# Altium project STLinkUART.PrjPcb
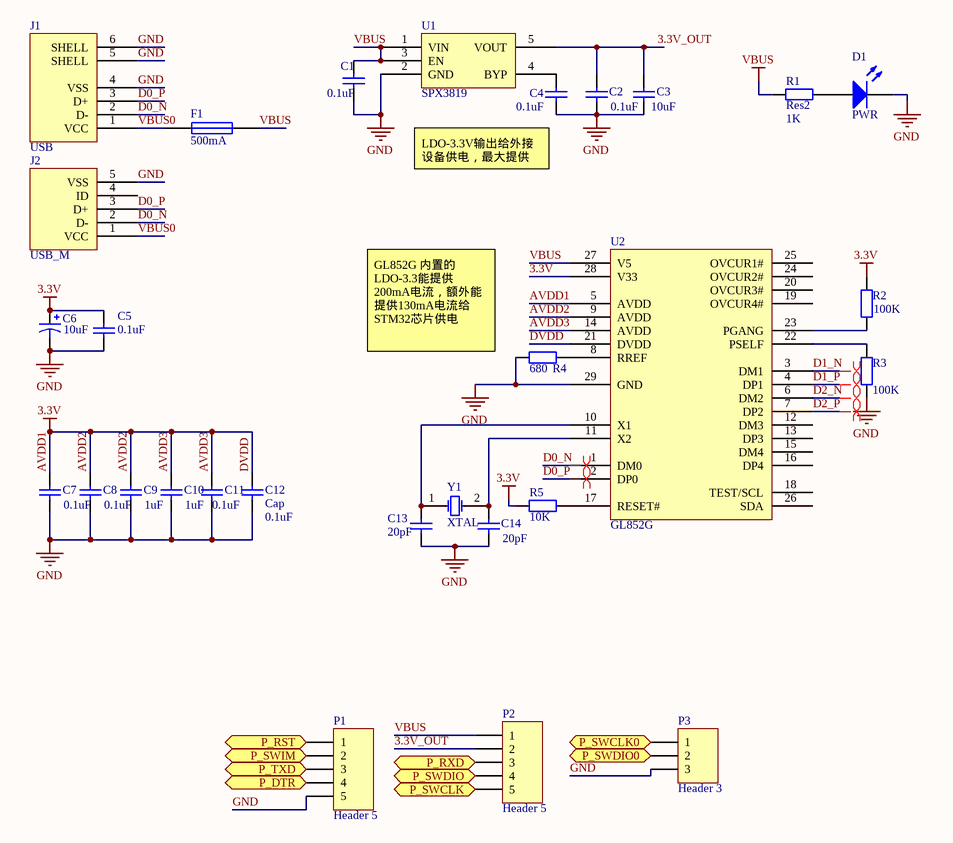
[diagram p0: USBHost.SchDoc]
3 sheets, 66 parts. Net scope: global (net labels, ports and power ports of the same name join across sheets).
Board file: STLinkUART.PcbDoc
Sheets:
  USBHost.SchDoc
  UART.SchDoc
  STLink.SchDoc

## Sheet USBHost.SchDoc
size A; PageSetup: Record=PageOptions|CenterHorizontal=True|CenterVertical=True|PrintScale=1.07|XCorrection=1.00|YCorrection=1.00|PrintKind=1|BorderSize=5000000|LeftOffset=0|BottomOffset=0|Orientation=2|PaperLength=1000|PaperWidth=1000|Scale=100|PaperSource=257|PrintQuality=600|MediaType=1|DitherType=10|PrintScaleMode=1|PaperKind=Letter|PaperIndex=1

### Parts
C1  value 0.1uF  [C-0603]  (hidden comment: Cap)
C2  value 0.1uF  [C-0603]  (hidden comment: Cap)
C3  value 10uF  [C-0603]  (hidden comment: Cap)
C4  value 0.1uF  [C-0603]  (hidden comment: Cap)
C5  value 0.1uF  [C-0603]  (hidden comment: Cap)
C6  value 10uF  [C-0603]  (hidden comment: Cap Pol1)
C7  value 0.1uF  [C-0603]  (hidden comment: Cap)
C8  value 0.1uF  [C-0603]  (hidden comment: Cap)
C9  value 1uF  [C-0603]  (hidden comment: Cap)
C10  value 1uF  [C-0603]  (hidden comment: Cap)
C11  value 0.1uF  [C-0603]  (hidden comment: Cap)
C12  Cap  value 0.1uF  [C-0603]
C13  value 20pF  [C-0603]  (hidden comment: Cap)
C14  value 20pF  [C-0603]  (hidden comment: Cap)
D1  PWR  [SMT_LED_0603]
F1  value 500mA  [0805-1]  (hidden comment: Fuse1)
J1  USB  [USB-B]
J2  USB_M  [USB_MICRO_5S_B]
P1  Header 5  [HEADER 5]
P2  Header 5  [HEADER 5]
P3  Header 3  [SIP3-1.27]
R1  Res2  value 1K  [0603-1]
R2  value 100K  [0603-1]  (hidden comment: Res2)
R3  value 100K  [0603-1]  (hidden comment: Res2)
R4  value 680  [0603-1]  (hidden comment: Res1)
R5  value 10K  [0603-1]  (hidden comment: Res2)
U1  SPX3819  [SOT23-5]
U2  GL852G  [QFN28-L]
Y1  XTAL  [XAL5032 2-Leads]

### Ports
P_DTR, P_RST, P_RXD, P_SWCLK, P_SWCLK0, P_SWDIO, P_SWDIO0, P_SWIM, P_TXD

### Nets
3.3V: C5.1 C6.1 C7.2 C8.2 C9.2 C10.2 C11.2 C12.2 R2.2 R5.2 U2.5(AVDD) U2.9(AVDD) U2.14(AVDD) U2.21(DVDD) U2.28(V33)  [also labelled AVDD1, AVDD2, AVDD3, DVDD]
GND: C1.1 C2.1 C3.1 C4.1 C5.2 C6.2 C7.1 C8.1 C9.1 C10.1 C11.1 C12.1 C13.1 C14.1 D1.2(K) J1.4(VSS) J1.5(SHELL) J1.6(SHELL) J2.5(VSS) P1.5 P3.3 R3.1 R4.1 U1.2(GND) U2.29(GND)
VBUS: C1.2 F1.1 P2.1 R1.1 U1.1(VIN) U1.3(EN) U2.27(V5)
3.3V_OUT: C2.2 C3.2 P2.2 U1.5(VOUT)
D0_N: J1.2(D-) J2.2(D-) U2.1(DM0)
D0_P: J1.3(D+) J2.3(D+) U2.2(DP0)
D1_N: U2.3(DM1)
D1_P: U2.4(DP1)
D2_N: U2.6(DM2)
D2_P: U2.7(DP2)
DTR: P1.4 ; port P_DTR
P_RST: P1.1 ; port P_RST
P_SWCLK: P2.5 ; port P_SWCLK
P_SWDIO: P2.4 ; port P_SWDIO
P_SWIM: P1.2 ; port P_SWIM
RXD: P2.3 ; port P_RXD
SWCLK0: P3.1 ; port P_SWCLK0
SWDIO0: P3.2 ; port P_SWDIO0
TXD: P1.3 ; port P_TXD
VBUS0: F1.2 J1.1(VCC) J2.1(VCC)
NetC4_2: C4.2 U1.4(BYP)
NetC13_2: C13.2 U2.10(X1) Y1.1(OSC1)
NetC14_2: C14.2 U2.11(X2) Y1.2(OSC2)
NetD1_1: D1.1(A) R1.2
NetR2_1: R2.1 U2.23(PGANG)
NetR3_2: R3.2 U2.22(PSELF)
NetR4_2: R4.2 U2.8(RREF)
NetR5_1: R5.1 U2.17(RESET#)

Not connected (* = marked no-connect by the designer): J2 4(ID); U2 12(DM3) 13(DP3) 15(DM4) 16(DP4) 18(TEST/SCL) 19(OVCUR4#) 20(OVCUR3#) 24(OVCUR2#) 25(OVCUR1#) 26(SDA)

### Layout directives
differential pair: D0_N, D0_P, D1_N, D1_P, D2_N, D2_P

### Notes on the sheet
- (near C4) LDO-3.3V输出给外接设备供电，最大提供500mA电流
- (near R4) GL852G 内置的LDO-3.3能提供200mA电流，额外能提供130mA电流给STM32芯片供电

### Library data of the parts
C1-C5 C7-C14 = Cap: Capacitor; Published: 8-Jun-2000; LatestRevisionDate: 17-Jul-2002; LatestRevisionNote: Re-released for DXP Platform.; PackageReference: RAD-0.3; Publisher: Altium Limited; PackageDescription: Radial Cap, Thru-Hole; 2 Leads; 0.3 in Pin Spacing
C6 = Cap Pol1: Polarized Capacitor (Radial); Published: 8-Jun-2000; LatestRevisionDate: 17-Jul-2002; LatestRevisionNote: Re-released for DXP Platform.; PackageReference: RB7.6-15; Publisher: Altium Limited; PackageDescription: Polarized Capacitor (Radial); 2 Leads
D1 = LED2: Typical RED, GREEN, YELLOW, AMBER GaAs LED; Published: 8-Jun-2000; LatestRevisionDate: 17-Jul-2002; LatestRevisionNote: Re-released for DXP Platform.; PackageVersion: Feb-2002; PackageReference: 3.2X1.6X1.1; Publisher: Altium Limited; PackageDescription: SM LED; 2 Flat Leads
F1 = Fuse1: 保险丝
J1 = USB: USB接口
J2 = USB_M: Micro/Mini USB
P1 P2 = Header 5: Header, 5-Pin; LatestRevisionDate: 17-Jul-2002; LatestRevisionNote: Re-released for DXP Platform.; Publisher: Altium Limited
P3 = Header 3: Header, 3-Pin; LatestRevisionDate: 17-Jul-2002; LatestRevisionNote: Re-released for DXP Platform.; Publisher: Altium Limited
R1-R3 R5 = Res2: Resistor; Published: 8-Jun-2000; LatestRevisionDate: 17-Jul-2002; LatestRevisionNote: Re-released for DXP Platform.; PackageReference: AXIAL-0.4; Publisher: Altium Limited; PackageDescription: Axial Device, Thru-Hole; 2 Leads; 0.4 in Pin Spacing
R4 = Res1: 贴片电阻; Published: 8-Jun-2000; LatestRevisionDate: 17-Jul-2002; LatestRevisionNote: Re-released for DXP Platform.; PackageReference: AXIAL-0.4; Publisher: Altium Limited
Y1 = XTAL: Crystal Oscillator; Published: 8-Jun-2000; LatestRevisionDate: 17-Jul-2002; LatestRevisionNote: Re-released for DXP Platform.; PackageReference: R38; Publisher: Altium Limited; PackageDescription: Crystal, Thru-Hole; 2 Leads; Body 3.1 x 8.2 mm (Dia.xH)

## Sheet UART.SchDoc
size A; PageSetup: Record=PageOptions|CenterHorizontal=True|CenterVertical=True|PrintScale=1.07|XCorrection=1.00|YCorrection=1.00|PrintKind=1|BorderSize=5000000|LeftOffset=0|BottomOffset=0|Orientation=2|PaperLength=1000|PaperWidth=1000|Scale=100|PaperSource=257|PrintQuality=600|MediaType=1|DitherType=10|PrintScaleMode=1|PaperKind=Letter|PaperIndex=1
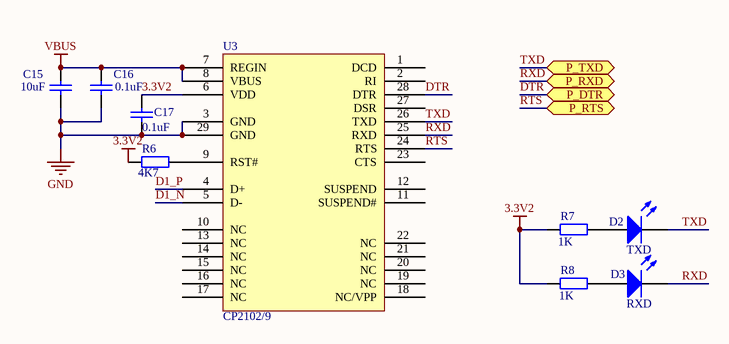
[diagram p1: UART.SchDoc]

### Parts
C15  value 10uF  [C-0603]  (hidden comment: Cap)
C16  value 0.1uF  [C-0603]  (hidden comment: Cap)
C17  value 0.1uF  [C-0603]  (hidden comment: Cap)
D2  TXD  [SMT_LED_0603]
D3  RXD  [SMT_LED_0603]
R6  value 4K7  [0603-1]  (hidden comment: Res2)
R7  value 1K  [0603-1]  (hidden comment: Res2)
R8  value 1K  [0603-1]  (hidden comment: Res2)
U3  CP2102/9  [QFN28-L]

### Ports
P_DTR, P_RTS, P_RXD, P_TXD

### Nets
3.3V2: C17.2 R6.1 R7.1 R8.1 U3.6(VDD)
GND: C15.1 C16.1 C17.1 U3.3(GND) U3.29(GND)
VBUS: C15.2 C16.2 U3.7(REGIN) U3.8(VBUS)
D1_N: U3.5(D-)
D1_P: U3.4(D+)
DTR: U3.28(DTR) ; port P_DTR
RTS: U3.24(RTS) ; port P_RTS
RXD: D3.2(K) U3.25(RXD) ; port P_RXD
TXD: D2.2(K) U3.26(TXD) ; port P_TXD
NetD2_1: D2.1(A) R7.2
NetD3_1: D3.1(A) R8.2
NetR6_2: R6.2 U3.9(RST#)

Not connected (* = marked no-connect by the designer): U3 1(DCD) 2(RI) 10(NC) 11(SUSPEND#) 12(SUSPEND) 13(NC) 14(NC) 15(NC) 16(NC) 17(NC) 18(NC/VPP) 19(NC) 20(NC) 21(NC) 22(NC) 23(CTS) 27(DSR)

### Library data of the parts
C15-C17 = Cap: Capacitor; Published: 8-Jun-2000; LatestRevisionDate: 17-Jul-2002; LatestRevisionNote: Re-released for DXP Platform.; PackageReference: RAD-0.3; Publisher: Altium Limited; PackageDescription: Radial Cap, Thru-Hole; 2 Leads; 0.3 in Pin Spacing
D2 D3 = LED2: as D1 on sheet USBHost; Published: 8-Jun-2000; LatestRevisionDate: 17-Jul-2002; LatestRevisionNote: Re-released for DXP Platform.; PackageVersion: Feb-2002; PackageReference: 3.2X1.6X1.1; Publisher: Altium Limited; PackageDescription: SM LED; 2 Flat Leads
R6-R8 = Res2: Resistor; Published: 8-Jun-2000; LatestRevisionDate: 17-Jul-2002; LatestRevisionNote: Re-released for DXP Platform.; PackageReference: AXIAL-0.4; Publisher: Altium Limited; PackageDescription: Axial Device, Thru-Hole; 2 Leads; 0.4 in Pin Spacing

## Sheet STLink.SchDoc
size A; PageSetup: Record=PageOptions|CenterHorizontal=True|CenterVertical=True|PrintScale=1.07|XCorrection=1.00|YCorrection=1.00|PrintKind=1|BorderSize=5000000|LeftOffset=0|BottomOffset=0|Orientation=2|PaperLength=1000|PaperWidth=1000|Scale=100|PaperSource=257|PrintQuality=600|MediaType=1|DitherType=10|PrintScaleMode=1|PaperKind=Letter|PaperIndex=1
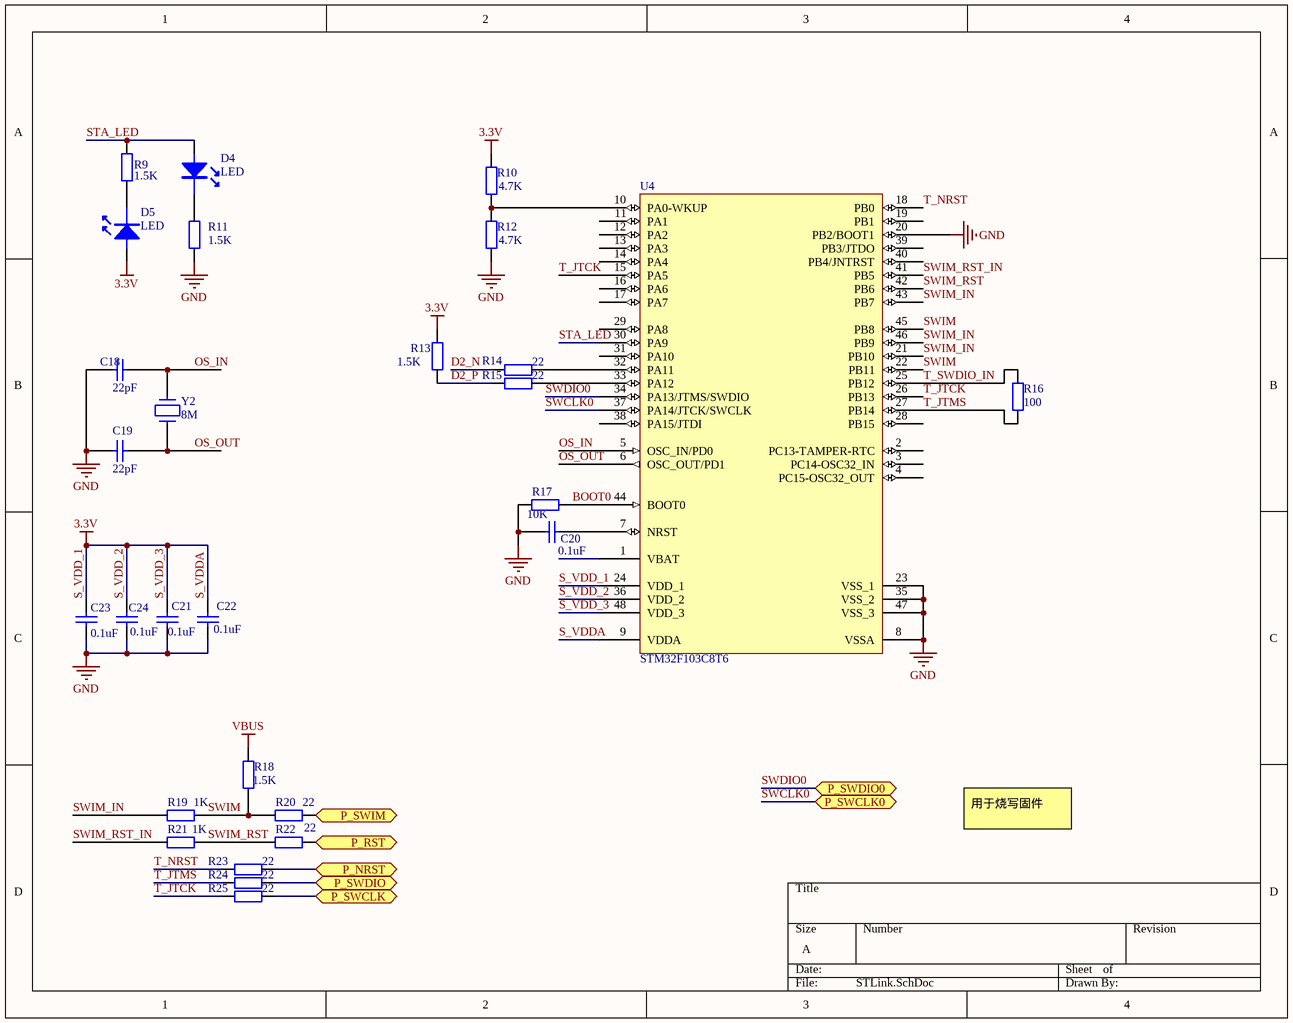
[diagram p2: STLink.SchDoc]

### Parts
C18  value 22pF  [C-0603]  (hidden comment: Cap)
C19  value 22pF  [C-0603]  (hidden comment: Cap)
C20  value 0.1uF  [C-0603]  (hidden comment: Cap)
C21  value 0.1uF  [C-0603]  (hidden comment: Cap)
C22  value 0.1uF  [C-0603]  (hidden comment: Cap)
C23  value 0.1uF  [C-0603]  (hidden comment: Cap)
C24  value 0.1uF  [C-0603]  (hidden comment: Cap)
D4  LED  [SMT_LED_0603]
D5  LED  [SMT_LED_0603]
R9  value 1.5K  [0603-1]  (hidden comment: Res2)
R10  value 4.7K  [0603-1]  (hidden comment: Res2)
R11  value 1.5K  [0603-1]  (hidden comment: Res2)
R12  value 4.7K  [0603-1]  (hidden comment: Res2)
R13  value 1.5K  [0603-1]  (hidden comment: Res2)
R14  value 22  [0603-1]  (hidden comment: Res2)
R15  value 22  [0603-1]  (hidden comment: Res2)
R16  value 100  [0603-1]  (hidden comment: Res2)
R17  value 10K  [0603-1]  (hidden comment: Res2)
R18  value 1.5K  [0603-1]  (hidden comment: Res2)
R19  value 1K  [0603-1]  (hidden comment: Res2)
R20  value 22  [0603-1]  (hidden comment: Res2)
R21  value 1K  [0603-1]  (hidden comment: Res2)
R22  value 22  [0603-1]  (hidden comment: Res2)
R23  value 22  [0603-1]  (hidden comment: Res2)
R24  value 22  [0603-1]  (hidden comment: Res2)
R25  value 22  [0603-1]  (hidden comment: Res2)
U4  STM32F103C8T6  [LQFP48_N]
Y2  8M  [XAL5032 2-Leads]

### Ports
P_NRST, P_RST, P_SWCLK, P_SWCLK0, P_SWDIO, P_SWDIO0, P_SWIM

### Nets
3.3V: C21.2 C22.2 C23.2 C24.2 D5.1(A) R10.2 R13.2 U4.9(VDDA) U4.24(VDD_1) U4.36(VDD_2) U4.48(VDD_3)  [also labelled S_VDD_1, S_VDD_2, S_VDD_3, S_VDDA]
GND: C18.1 C19.1 C20.1 C21.1 C22.1 C23.1 C24.1 R11.1 R12.1 R17.1 U4.8(VSSA) U4.20(PB2/BOOT1) U4.23(VSS_1) U4.35(VSS_2) U4.47(VSS_3)
VBUS: R18.2
BOOT0: R17.2 U4.44(BOOT0)
D2_N: R14.1
D2_P: R13.1 R15.1
OS_IN: C18.2 U4.5(OSC_IN/PD0) Y2.2
OS_OUT: C19.2 U4.6(OSC_OUT/PD1) Y2.1
P_NRST: R23.2 ; port P_NRST
P_RST: R22.2 ; port P_RST
P_SWCLK: R25.2 ; port P_SWCLK
P_SWDIO: R24.2 ; port P_SWDIO
P_SWIM: R20.2 ; port P_SWIM
STA_LED: D4.1(A) R9.2 U4.30(PA9)
SWCLK0: U4.37(PA14/JTCK/SWCLK) ; port P_SWCLK0
SWDIO0: U4.34(PA13/JTMS/SWDIO) ; port P_SWDIO0
SWIM: R18.1 R19.2 R20.1 U4.22(PB11) U4.45(PB8)
SWIM_IN: R19.1 U4.21(PB10) U4.43(PB7) U4.46(PB9)
SWIM_RST: R21.2 R22.1 U4.42(PB6)
SWIM_RST_IN: R21.1 U4.41(PB5)
T_JTCK: R25.1 U4.15(PA5) U4.26(PB13)
T_JTMS: R16.1 R24.1 U4.27(PB14)
T_NRST: R23.1 U4.18(PB0)
T_SWDIO_IN: R16.2 U4.25(PB12)
NetC20_2: C20.2 U4.7(NRST)
NetD4_2: D4.2(K) R11.2
NetD5_2: D5.2(K) R9.1
NetR10_1: R10.1 R12.2 U4.10(PA0-WKUP)
NetR14_2: R14.2 U4.32(PA11)
NetR15_2: R15.2 U4.33(PA12)

Not connected (* = marked no-connect by the designer): U4 1(VBAT) 2(PC13-TAMPER-RTC) 3(PC14-OSC32_IN) 4(PC15-OSC32_OUT) 11(PA1) 12(PA2) 13(PA3) 14(PA4) 16(PA6) 17(PA7) 19(PB1) 28(PB15) 29(PA8) 31(PA10) 38(PA15/JTDI) 39(PB3/JTDO) 40(PB4/JNTRST)

### Notes on the sheet
- 用于烧写固件

### Library data of the parts
C21-C24 = Cap: Capacitor; Published: 8-Jun-2000; LatestRevisionDate: 17-Jul-2002; LatestRevisionNote: Re-released for DXP Platform.; PackageReference: RAD-0.3; Publisher: Altium Limited; PackageDescription: Radial Cap, Thru-Hole; 2 Leads; 0.3 in Pin Spacing
D4 D5 = LED: LED 发光二极管
R9-R25 = Res2: Resistor; Published: 8-Jun-2000; LatestRevisionDate: 17-Jul-2002; LatestRevisionNote: Re-released for DXP Platform.; PackageReference: AXIAL-0.4; Publisher: Altium Limited; PackageDescription: Axial Device, Thru-Hole; 2 Leads; 0.4 in Pin Spacing
U4 = STM32F103C8T6: STM32 ARM-based 32-bit MCU with 64 Kbytes Flash, 48-pin LQFP, Industrial Temperature; Published: 30-May-2008; DatasheetVersion: rev6, Mar-2008; PackageVersion: Mar-2008; PackageReference: LQFP48; Publisher: Altium Limited; PackageDescription: 48-Pin Low-Profile Quad Flat Pack, 7 x 7 mm Body, 0.5 mm Pitch (LQFP48); ComponentLink1Description: Manufacturer Link; ComponentLink1URL: www.st.com/stm32; ComponentLink2Description: Datasheet; ComponentLink2URL: http://www.st.com/stonline/products/literature/ds/13587.pdf
Y2 = XTAL

## Nets that join several sheets
3.3V: USBHost (15 pins), STLink (11 pins)
GND: USBHost (25 pins), UART (5 pins), STLink (15 pins)
VBUS: USBHost (7 pins), UART (C15.2 C16.2 U3.7 U3.8), STLink (R18.2)
D1_N: USBHost (U2.3), UART (U3.5)
D1_P: USBHost (U2.4), UART (U3.4)
D2_N: USBHost (U2.6), STLink (R14.1)
D2_P: USBHost (U2.7), STLink (R13.1 R15.1)
DTR: USBHost (P1.4), UART (U3.28)
P_RST: USBHost (P1.1), STLink (R22.2)
P_SWCLK: USBHost (P2.5), STLink (R25.2)
P_SWDIO: USBHost (P2.4), STLink (R24.2)
P_SWIM: USBHost (P1.2), STLink (R20.2)
RXD: USBHost (P2.3), UART (D3.2 U3.25)
SWCLK0: USBHost (P3.1), STLink (U4.37)
SWDIO0: USBHost (P3.2), STLink (U4.34)
TXD: USBHost (P1.3), UART (D2.2 U3.26)